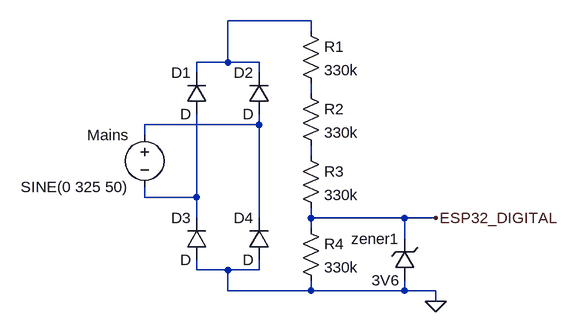
[diagram p0: schematic time_reference.asc]
time_reference.asc, the LTspice schematic file:
Version 4
SHEET 1 880 680
WIRE 368 -64 240 -64
WIRE 368 -48 368 -64
WIRE 240 0 240 -64
WIRE 240 0 192 0
WIRE 288 0 240 0
WIRE 192 16 192 0
WIRE 288 16 288 0
WIRE 368 48 368 32
WIRE 288 96 288 80
WIRE 288 96 112 96
WIRE 112 112 112 96
WIRE 368 144 368 128
WIRE 112 208 112 192
WIRE 192 208 192 80
WIRE 192 208 112 208
WIRE 192 240 192 208
WIRE 288 240 288 96
WIRE 368 240 368 224
WIRE 512 240 368 240
WIRE 560 240 512 240
WIRE 368 256 368 240
WIRE 512 272 512 240
WIRE 192 320 192 304
WIRE 240 320 192 320
WIRE 288 320 288 304
WIRE 288 320 240 320
WIRE 240 352 240 320
WIRE 368 352 368 336
WIRE 368 352 240 352
WIRE 512 352 512 336
WIRE 512 352 368 352
WIRE 560 352 512 352
WIRE 560 368 560 352
FLAG 560 368 0
FLAG 560 240 ESP32_DIGITAL
SYMBOL voltage 112 96 M0
WINDOW 123 0 0 Left 0
WINDOW 39 0 0 Left 0
SYMATTR InstName Mains
SYMATTR Value SINE(0 325 50)
SYMBOL diode 208 80 R180
WINDOW 0 24 64 Left 2
WINDOW 3 24 0 Left 2
SYMATTR InstName D1
SYMBOL diode 304 80 R180
WINDOW 0 24 64 Left 2
WINDOW 3 24 0 Left 2
SYMATTR InstName D2
SYMBOL diode 208 304 R180
WINDOW 0 24 64 Left 2
WINDOW 3 24 0 Left 2
SYMATTR InstName D3
SYMBOL diode 304 304 R180
WINDOW 0 24 64 Left 2
WINDOW 3 24 0 Left 2
SYMATTR InstName D4
SYMBOL res 352 -64 R0
SYMATTR InstName R1
SYMATTR Value 330k
SYMBOL res 352 32 R0
SYMATTR InstName R2
SYMATTR Value 330k
SYMBOL res 352 128 R0
SYMATTR InstName R3
SYMATTR Value 330k
SYMBOL res 352 240 R0
SYMATTR InstName R4
SYMATTR Value 330k
SYMBOL zener 528 336 R180
WINDOW 0 24 64 Left 2
WINDOW 3 24 0 Left 2
SYMATTR InstName zener1
SYMATTR Value 3V6

The netlist it stands for:
* time_reference.asc
V§Mains N003 N005 SINE(0 325 50)
D1 N005 N001 D
D2 N003 N001 D
D3 0 N005 D
D4 0 N003 D
R1 N001 N002 330k
R2 N002 N004 330k
R3 N004 ESP32_DIGITAL 330k
R4 ESP32_DIGITAL 0 330k
D§zener1 0 ESP32_DIGITAL 3V6
.model D D
.lib standard.dio
.backanno
.end